# EAGLE design generic (EAGLE 7.2.0)
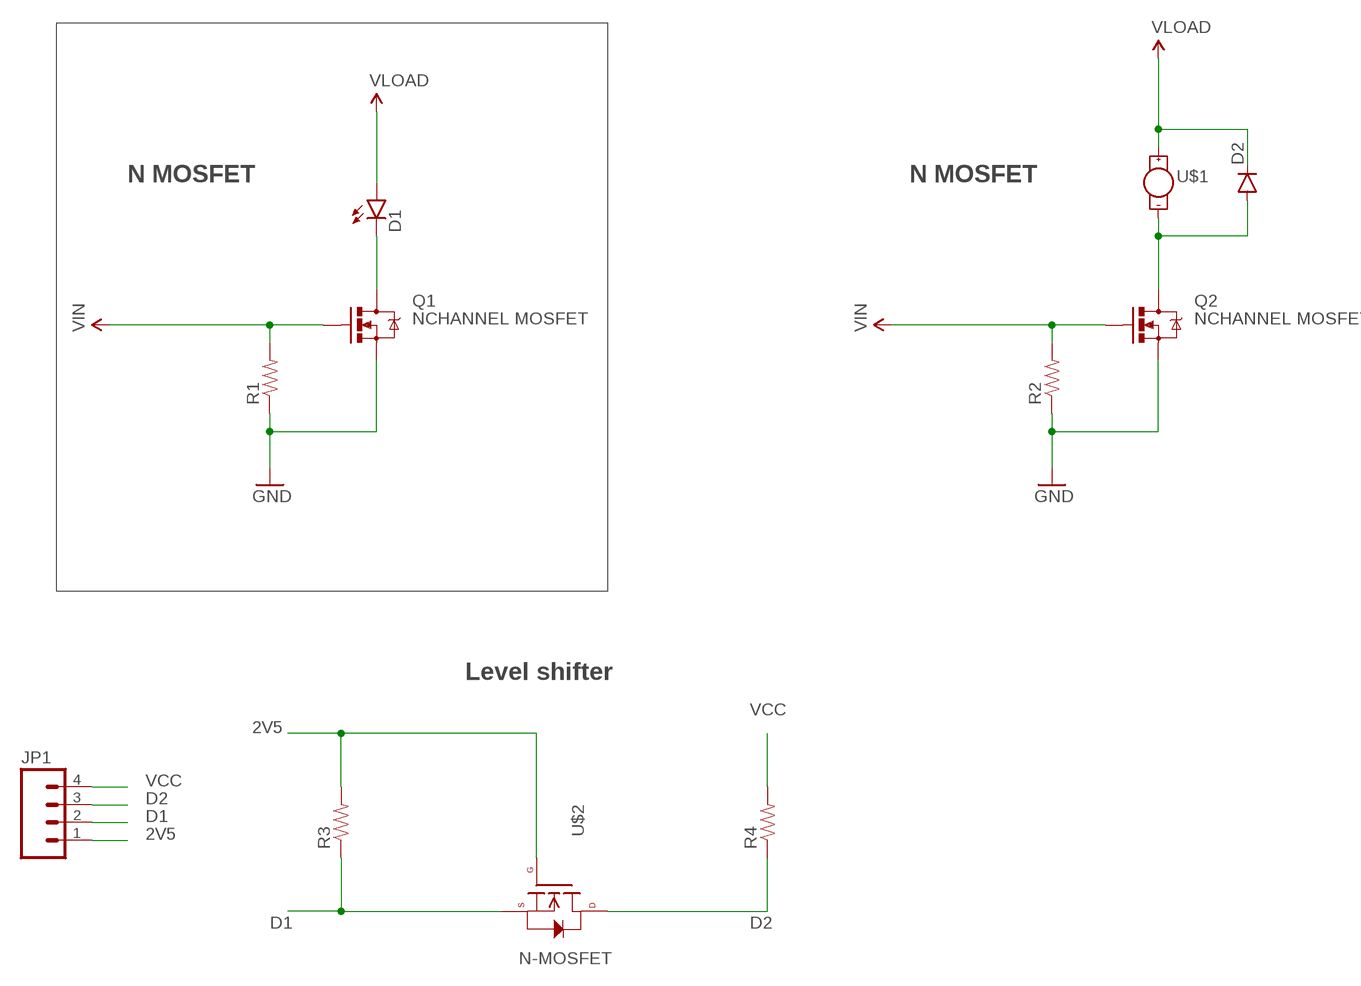
[diagram p0: schematic, sheet 1]

## Parts
D1  LED0603  [LED-0603]
D2  DIODESMB  [SMB-DIODE]
JP1  M04PTH  [1X04]
Q1  NCHANNEL MOSFET  MOSFET-NCHANNEL2N7002PW  [SOT323]
Q2  NCHANNEL MOSFET  MOSFET-NCHANNEL2N7002PW  [SOT323]
R1  RESISTOR0603-RES  [0603-RES]
R2  RESISTOR0603-RES  [0603-RES]
R3  RESISTOR0603-RES  [0603-RES]
R4  RESISTOR0603-RES  [0603-RES]
U$1  MOTOR10MM  [VIBE-MOTOR-10MM]
U$2  N-MOSFET  N-CHANNEL-MOSFET-BSS138  [SOT23-3]

## Nets
2V5: JP1.1 R3.2 U$2.1(G)
5V: D1.A D2.C ; supply symbol labelled VLOAD
D1: JP1.2 R3.1 U$2.2(S)
D2: JP1.3 R4.1 U$2.3(D)
GND: Q1.2(S) Q2.2(S) R1.1 R2.1
N$1: D2.A Q2.3(D)
N$2: D1.C Q1.3(D)
VCC: JP1.4 R4.2
VIN: Q1.1(G) Q2.1(G) R1.2 R2.2
Unconnected: U$1.+ U$1.-

## Notes on the sheet
- N MOSFET | N MOSFET
- Level shifter

## Library data of the parts
D1 = SparkFun-LED:LED: LEDs Standard schematic elements and footprints for 5mm, 3mm, 1206, and 0603 sized LEDs. 5mm - Spark Fun Electronics SKU : COM-00529 (and others)
D2 = SparkFun-DiscreteSemi:DIODE: Diode These are standard reverse protection diodes and small signal diodes. SMA package can handle up to about 1A. SOD-323 can handle about 200mA. What the SOD-323 package when ordering, there are some mfgs out there that are 5-pin packages.; PROD_ID: DIO-09646
JP1 = SparkFun-Connectors:M04: Header 4 Standard 4-pin 0.1" header. Use with straight break away headers (SKU : PRT-00116), right angle break away headers (PRT-00553), swiss pins (PRT-00743), machine pins (PRT-00117), and female headers (PRT-00115). Molex polarized connector foot print use with SKU : PRT-08231 with associated crimp pins and housings. 1MM SMD Version SKU: PRT-10208
Q1 Q2 = SparkFun-DiscreteSemi:MOSFET-NCHANNEL: Common NMOSFET Parts MFG P/N Store ID Prod ID FDD8780 TRANS-09984 SI7820DN TRANS-11055 FDS6630A IC-08089 2N7002PW TRANS-11151 FQP30N06L COM-10213 TRANS-10060 BSS123LT1G TRANS-08345 BSS138 TRANS-00830 BS170 2N7000; PROD_ID: TRANS-11151
R1-R4 = SparkFun-Passives:RESISTOR: Resistor Basic schematic elements and footprints for 0603, 1206, and PTH resistors.
U$1 = SparkFun-Electromechanical:MOTOR: Vibration Motor- ROB-08449 Physical dimension and wire connections for this powerful vibration motor. Motor has a self adhesive backing.
U$2 = GeekAmmo:N-CHANNEL-MOSFET: N-Channel MOSFET Mode Field Effect Transistor; DATASHEET: http://www.fairchildsemi.com/ds/BS/BSS138.pdf; DIGIKEY: BSS138TR-ND; ELEMENT14: 2323154; URL: http://au.element14.com/fairchild-semiconductor/bss138/mosfet-n-ch-50v-220ma-sot-23/dp/2323154

## Board
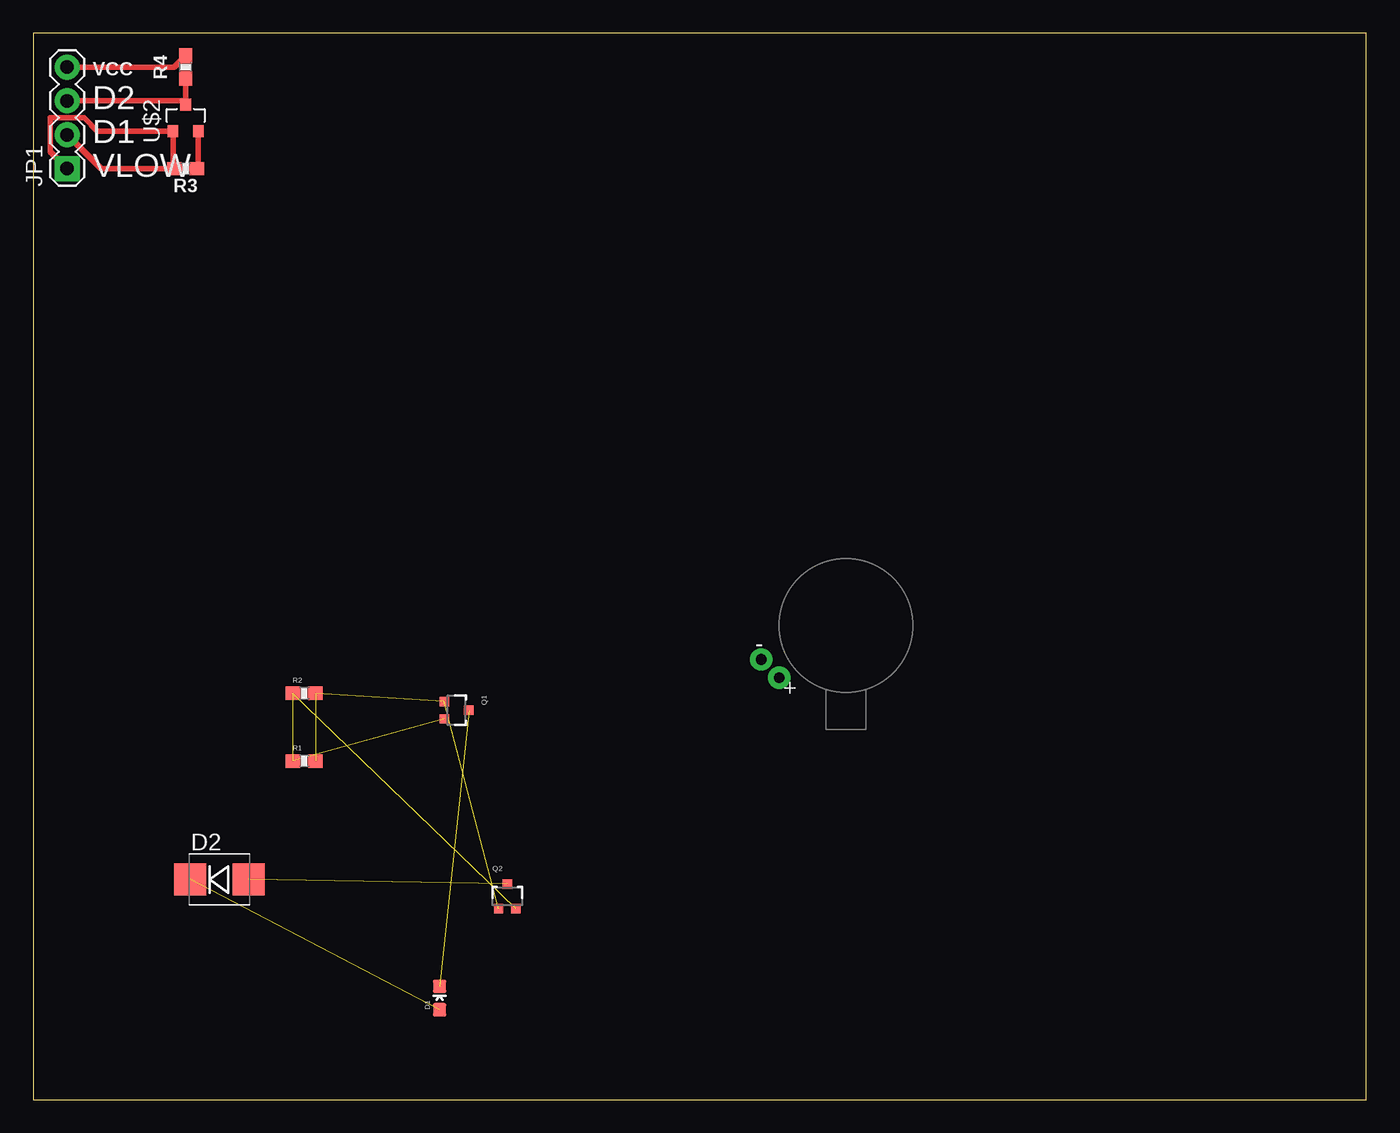
[diagram p1: board, top side]

Size 100 x 80 mm. Coordinates in mm from the lower left corner, seen from the top.
Outline: 0,0 100,0 100,80 0,80 0,0
Copper layers (1*16): Top 0.035mm / dielectric 1.5mm / Bottom 0.035mm
Design rules "default": minimum track width 10mil, minimum drill 24mil, track to track 8mil, track to pad 8mil, pad to pad 8mil, via to via 8mil, smd to smd 8mil, copper to edge 40mil, drill to drill 8mil, minimum pad ring 10mil, minimum via ring 8mil, stop-mask expansion 4mil, vias tented up to drill 0mil, thermal gap 10mil

### Footprints (pad centres in the part's own frame; a part is rotated, then mirrored left to right if it is on the bottom)
LED-0603 = smd 1 x 1: A 0,-0.877; C 0,0.877
SMB-DIODE = smd 2.4 x 2.4: A 2.2,0; C -2.2,0
1X04 = drill 1.016 pad 1.88 square: 1 0,0 | drill 1.016 pad 1.88: 2 2.54,0; 3 5.08,0; 4 7.62,0
SOT323 = smd 0.7 x 0.7: 1 -0.65,-0.925; 2 0.65,-0.925; 3 0,0.925
0603-RES = smd 1.1 x 1: 1 -0.85,0; 2 0.85,0
VIBE-MOTOR-10MM = drill 0.8 pad 1.676: + -5,-3.9; - -6.35,-2.54
SOT23-3 = smd 0.8 x 0.9: 1 -0.95,-1; 2 0.95,-1; 3 0,1

### Placement (x,y rotation side)
D1  30.48,7.62 0 top
D2  13.97,16.51 0 top
JP1  2.54,69.85 90 top
Q1  31.75,29.21 270 top
Q2  35.56,15.24 0 top
R1  20.32,25.4 0 top
R2  20.32,30.48 0 top
R3  11.43,69.85 180 top
R4  11.43,77.47 90 top
U$1  60.96,35.56 0 top
U$2  11.43,73.66 0 top

### Tracks (layer width: path | path; a pad name or v marks a point on that pad's centre or on a via)
2V5
  Top 0.406: R3.2 10.48,69.95 U$2.1 4.81,72.66 3.81,73.66 1.27,73.66 1.27,71.12 JP1.1
5V  (1 unrouted)
D1
  Top 0.406: U$2.2 12.38,69.95 R3.1 5.08,69.85 JP1.2
D2
  Top 0.406: JP1.3 11.16,74.93 U$2.3 R4.1
GND  (3 unrouted)
N$1  (1 unrouted)
N$2  (1 unrouted)
VCC
  Top 0.406: JP1.4 10.58,77.47 R4.2
VIN  (3 unrouted)

### Text on the board
tNames: VCC | D2 | D1 | VLOW